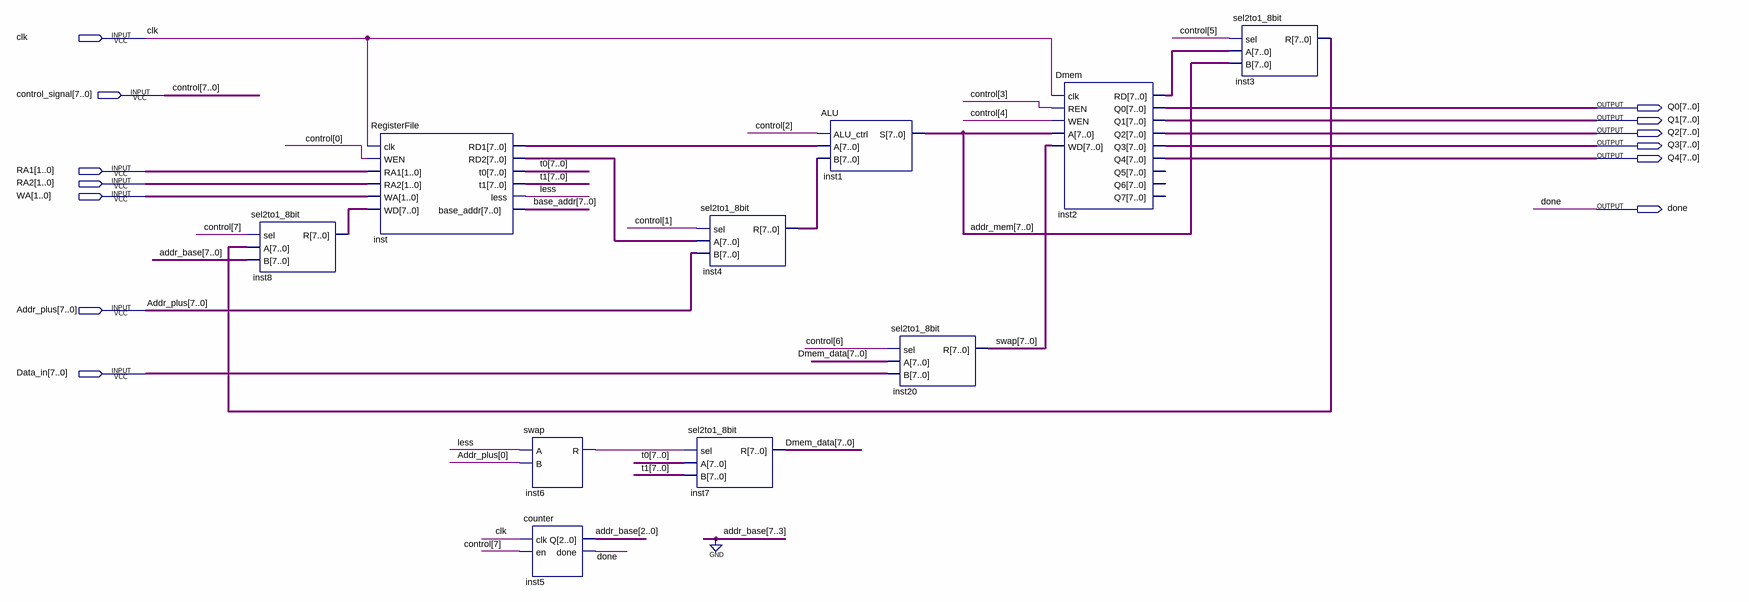
[diagram p0: schematic sheet]
// Quartus schematic Datapath.bdf as structural Verilog: 10 symbols, 13 pins
module Datapath (
  input  clk,
  input  [7:0] control_signal,
  input  [1:0] RA1,
  input  [1:0] RA2,
  input  [1:0] WA,
  input  [7:0] Addr_plus,
  input  [7:0] Data_in,
  output [7:0] Q0,
  output [7:0] Q1,
  output [7:0] Q2,
  output [7:0] Q3,
  output [7:0] Q4,
  output done
);

  wire inst6_r, less;
  wire [2:0] addr_base;
  wire [7:0] addr_mem, base_addr, Dmem_data, inst2_rd, inst3_r, inst4_r, inst8_r, inst_rd1, inst_rd2, swap,
       t0, t1;

  sel2to1_8bit inst8 (.sel(control_signal[7]), .A(inst3_r), .B({{5{1'b0}}, addr_base}), .R(inst8_r));
  RegisterFile inst (
    .clk(clk), .WEN(control_signal[0]), .RA1(RA1), .RA2(RA2), .WA(WA), .WD(inst8_r), .RD1(inst_rd1),
    .RD2(inst_rd2), .t0(t0), .t1(t1), .less(less), .base_addr(base_addr));
  swap inst6 (.A(less), .B(Addr_plus[0]), .R(inst6_r));
  counter inst5 (.clk(clk), .en(control_signal[7]), .Q(addr_base), .done(done));
  sel2to1_8bit inst4 (.sel(control_signal[1]), .A(inst_rd2), .B(Addr_plus), .R(inst4_r));
  sel2to1_8bit inst7 (.sel(inst6_r), .A(t0), .B(t1), .R(Dmem_data));
  ALU inst1 (.ALU_ctrl(control_signal[2]), .A(inst_rd1), .B(inst4_r), .S(addr_mem));
  sel2to1_8bit inst20 (.sel(control_signal[6]), .A(Dmem_data), .B(Data_in), .R(swap));
  Dmem inst2 (
    .clk(clk), .REN(control_signal[3]), .WEN(control_signal[4]), .A(addr_mem), .WD(swap), .RD(inst2_rd),
    .Q0(Q0), .Q1(Q1), .Q2(Q2), .Q3(Q3), .Q4(Q4));  // open: Q5, Q6, Q7
  sel2to1_8bit inst3 (.sel(control_signal[5]), .A(inst2_rd), .B(addr_mem), .R(inst3_r));

  // Other names for the same wires on the sheet: control[7:0] = control_signal
endmodule
